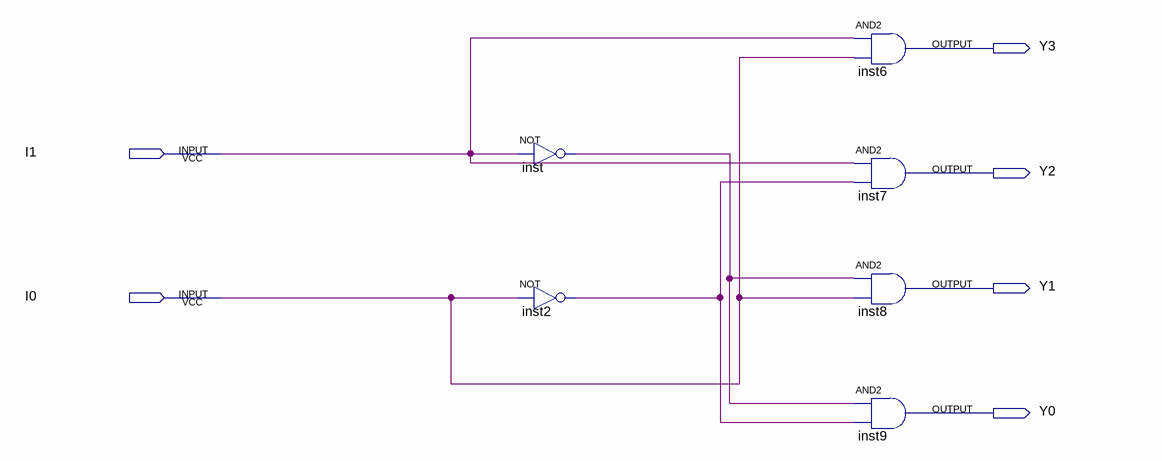
[diagram p0: schematic sheet]
// Quartus schematic decoder2_4.bdf as structural Verilog: 6 symbols, 6 pins
module decoder2_4 (
  input  I1,
  input  I0,
  output Y3,
  output Y2,
  output Y1,
  output Y0
);

  wire inst2_out, inst_out;

  not inst (inst_out, I1);
  not inst2 (inst2_out, I0);
  and inst6 (Y3, I1, I0);
  and inst7 (Y2, I1, inst2_out);
  and inst8 (Y1, inst_out, I0);
  and inst9 (Y0, inst_out, inst2_out);
endmodule
